# EAGLE schematic ScaleBreakoutBoard2.0 (3) (EAGLE 9.6.2)
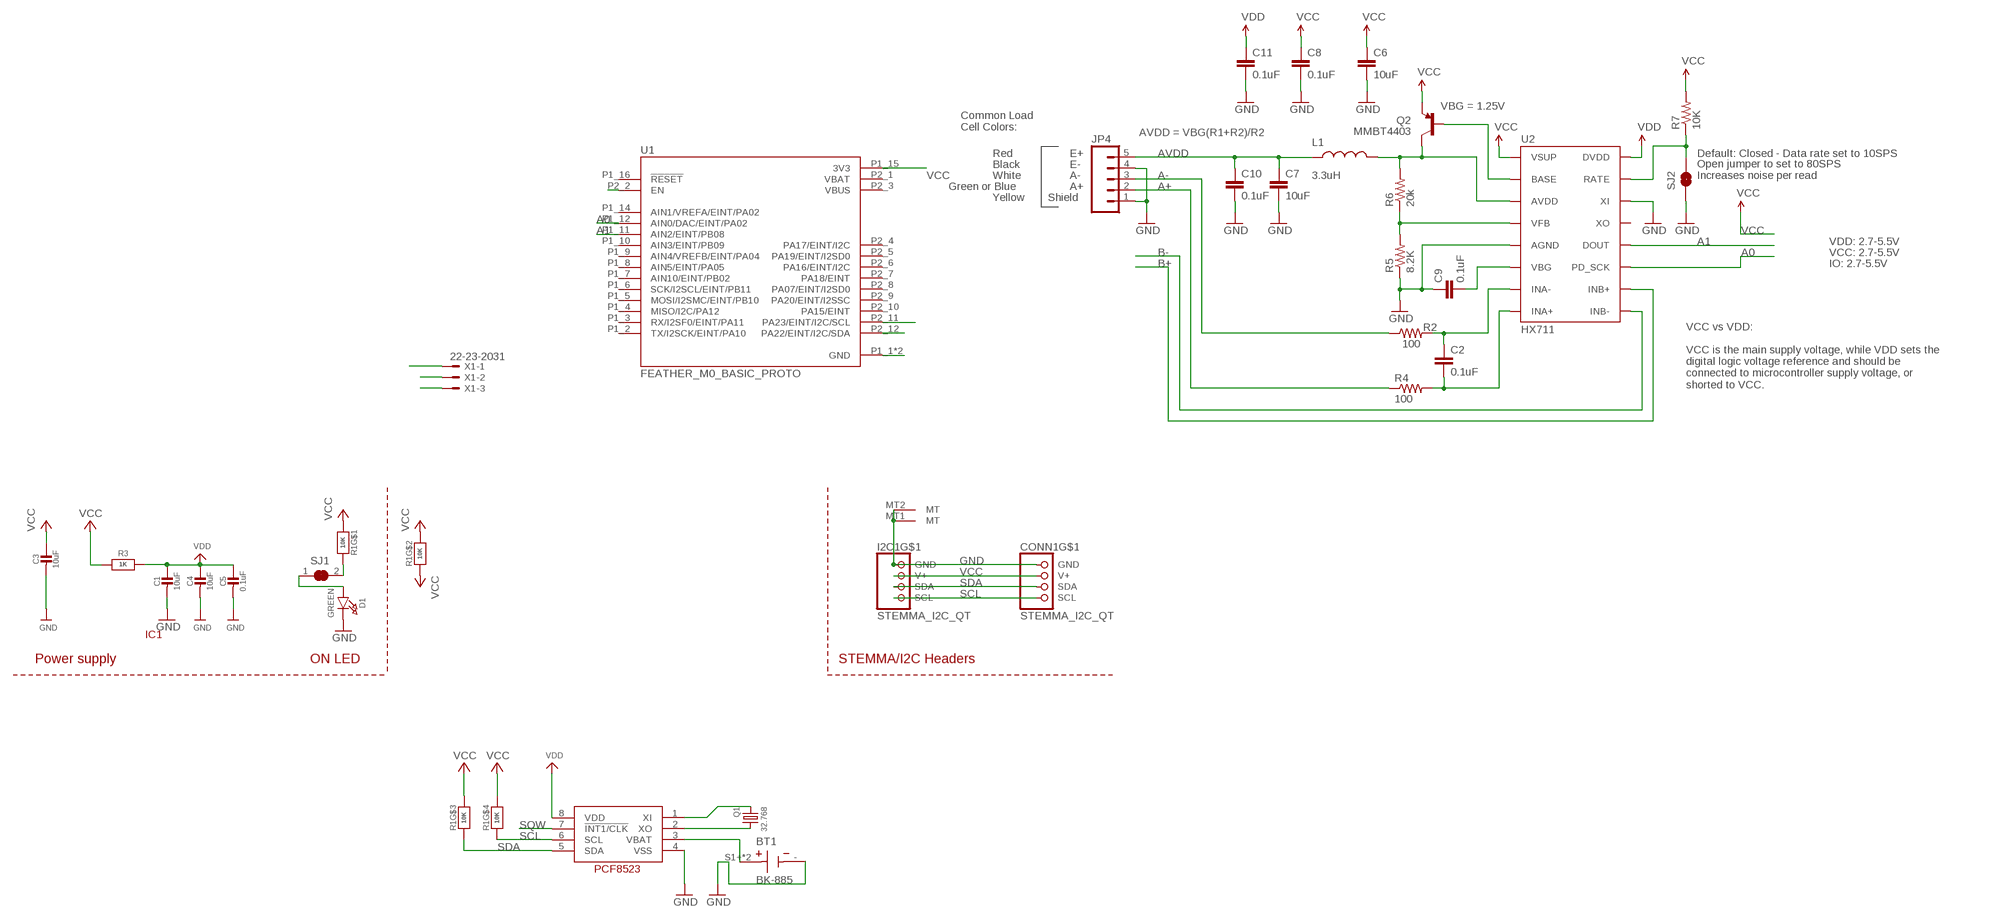
[diagram p0: schematic, sheet 1]

## Parts
BT1  BK-885  [BAT_BK-885]
C1  10uF  CAP_CERAMIC0805-NOOUTLINE  [0805-NO]
C2  0.1uF  0.1UF-25V-5%(0603)  [0603-CAP]
C3  10uF  CAP_CERAMIC0805-NOOUTLINE  [0805-NO]
C4  10uF  CAP_CERAMIC0805-NOOUTLINE  [0805-NO]
C5  0.1uF  CAP_CERAMIC0603_NO  [0603-NO]
C6  10uF  10UF50V20%(1210)  [1210]
C7  10uF  10UF50V20%(1210)  [1210]
C8  0.1uF  0.1UF-25V-5%(0603)  [0603-CAP]
C9  0.1uF  0.1UF-25V-5%(0603)  [0603-CAP]
C10  0.1uF  0.1UF-25V-5%(0603)  [0603-CAP]
C11  0.1uF  0.1UF-25V-5%(0603)  [0603-CAP]
CONN1  STEMMA_I2C_QT  [JST_SH4]
D1  GREEN  LED0603_NOOUTLINE  [CHIPLED_0603_NOOUTLINE]
I2C1  STEMMA_I2C_QT  [JST_SH4]
IC1  RTC_PCF8523T  [SOIC8_150MIL]
JP4  M05PTH  [1X05]
L1  3.3uH  INDUCTOR0805-IND  [0805]
Q1  32.768  CRYSTAL_3215  [XTAL3215]
Q2  MMBT4403  TRANSISTOR_PNPMMBT4403  [SOT23-3]
R1  10K  RESISTOR_4PACK  [RESPACK_4X0603]
R2  100  100OHM-1/10W-1%(0603)  [0603-RES]
R3  1K  RESISTOR_0603_NOOUT  [0603-NO]
R4  100  100OHM-1/10W-1%(0603)  [0603-RES]
R5  8.2K  8.2KOHM-1/10W-5%(0603)  [0603-RES]
R6  20k  20KOHM1/10W1%(0603)  [0603-RES]
R7  10K  10KOHM-1/10W-1%(0603)0603  [0603-RES]
SJ1  SOLDERJUMPER_CLOSED  [SOLDERJUMPER_CLOSEDWIRE]
SJ2  JUMPER-PAD-2-NC_BY_TRACE  [PAD-JUMPER-2-NC_BY_TRACE_YES_SILK]
U1  FEATHER_M0_BASIC_PROTO  [MODULE_FEATHER_M0_BASIC_PROTO]
U2  HX711  HX711HX711  [SO16]
X1  22-23-2031  [22-23-2031]

## Nets
A0: U1.P1_12(AIN0/DAC/EINT/PA02) U2.11(PD_SCK)
A1: U1.P1_11(AIN2/EINT/PB08) U2.12(DOUT)
A+: JP4.2 R4.1
A-: JP4.3 R2.1
AVDD: C7.1 C10.1 JP4.5 L1.1
B+: U2.10(INB+)
B-: U2.9(INB-)
EN: U1.P2_2(EN) X1.3
GND: BT1.- C1.2 C3.2 C4.2 C5.2 C6.2 C7.2 C8.2 C9.1 C10.2 C11.2 CONN1.1(GND) D1.C I2C1.1(GND) I2C1.MT1(MT) I2C1.MT2(MT) IC1.4(VSS) JP4.1 JP4.4 R5.1 SJ2.1 U1.P1_1(GND) U1.P1_13(GND) U2.5(AGND) U2.14(XI) X1.1 X1.2
N$1: R1.8 SJ1.2
N$2: Q2.1(B) U2.2(BASE)
N$3: R7.1 SJ2.2 U2.15(RATE)
N$4: D1.A SJ1.1
N$5: L1.2 Q2.3(C) R6.2 U2.3(AVDD)
N$6: R5.2 R6.1 U2.4(VFB)
N$7: C9.2 U2.6(VBG)
N$8: C2.1 R2.2 U2.7(INA-)
N$9: C2.2 R4.2 U2.8(INA+)
N$14: IC1.1(XI) Q1.P$1
N$15: IC1.2(XO) Q1.P$2
SCL: CONN1.4(SCL) I2C1.4(SCL) IC1.6(SCL) R1.4 U1.P2_11(PA23/EINT/I2C/SCL)
SDA: CONN1.3(SDA) I2C1.3(SDA) IC1.5(SDA) R1.3 U1.P2_12(PA22/EINT/I2C/SDA)
SQW: IC1.7(!INT1/CLK)
VBAT1: BT1.S1+(+) BT1.S2+(+) IC1.3(VBAT)
VCC: C3.1 C6.1 C8.1 CONN1.2(V+) I2C1.2(V+) Q2.2(E) R1.1 R1.2 R1.5 R1.6 R1.7 R3.1 R7.2 U1.P1_15(3V3) U2.1(VSUP)
VDD: C1.1 C4.1 C5.1 C11.1 IC1.8(VDD) R3.2 U2.16(DVDD)
Unconnected: CONN1.MT1(MT) CONN1.MT2(MT) U1.P1_2(TX/I2SCK/EINT/PA10) U1.P1_3(RX/I2SF0/EINT/PA11) U1.P1_4(MISO/I2C/PA12) U1.P1_5(MOSI/I2SMC/EINT/PB10) U1.P1_6(SCK/I2SCL/EINT/PB11) U1.P1_7(AIN10/EINT/PB02) U1.P1_8(AIN5/EINT/PA05) U1.P1_9(AIN4/VREFB/EINT/PA04) U1.P1_10(AIN3/EINT/PB09) U1.P1_14(AIN1/VREFA/EINT/PA02) U1.P1_16(!RESET) U1.P2_4(PA17/EINT/I2C) U1.P2_5(PA19/EINT/I2SD0) U1.P2_6(PA16/EINT/I2C) U1.P2_7(PA18/EINT) U1.P2_8(PA07/EINT/I2SD0) U1.P2_9(PA20/EINT/I2SSC) U1.P2_10(PA15/EINT) U2.13(XO)

## Notes on the sheet
- VBG = 1.25V
- Common Load
  Cell Colors:
- AVDD = VBG(R1+R2)/R2
- Red | E+ | Default: Closed - Data rate set to 10SPS
- Black | E-
- White | A-
- Open jumper to set to 80SPS
  Increases noise per read
- Green or Blue | A+
- Yellow | Shield
- VDD: 2.7-5.5V
- VCC: 2.7-5.5V
- IO: 2.7-5.5V
- VCC vs VDD:
  
  VCC is the main supply voltage, while VDD sets the
  digital logic voltage reference and should be
  connected to microcontroller supply voltage, or
  shorted to VCC.
- Power supply | ON LED | STEMMA/I2C Headers

## Power pins joined to a net without a drawn wire
VBAT: U1.P2_1(VBAT)
VBUS: U1.P2_3(VBUS)

## Library data of the parts
BT1 = BK-885:BK-885: BATTERY RETAINER COIN 12MM SMD Check prices <https://pricing.snapeda.com/parts/BK-885/MPD/view-part?ref=eda>; AVAILABILITY: In Stock; DESCRIPTION: BATTERY RETAINER COIN 12MM SMD; MF: MPD; MP: BK-885; PACKAGE: None; PRICE: None; PURCHASE-URL: https://pricing.snapeda.com/search/part/BK-885/?ref=eda
C1 C3-C5 = microbuilder:CAP_CERAMIC: Ceramic Capacitors For new designs, use the packages preceded by an '_' character since they are more reliable: The following footprints should be used on most boards: _0402 - Standard footprint for regular board layouts _0603 - Standard footprint for regular board layouts _0805 - Standard footprint for regular board layouts _1206 - Standard footprint for regular board layouts For extremely tight-pitch boards where space is at a premium, the following 'micro-pitch' footprints can be used (smaller pads, no silkscreen outline, etc.): _0402MP - Micro-pitch footprint for very dense/compact boards _0603MP - Micro-pitch footprint for very dense/compact boards _0805MP - Micro-pitch footprint for very dense/compact boards _1206MP - Micro-pitch footprint for very dense/compact boards
C2 C8-C11 = SparkFun-Capacitors:0.1UF-25V-5%(0603): CAP-08604; PROD_ID: CAP-08604
C6 C7 = SparkFun-Capacitors:10UF50V20%(1210): CAP-09824; PROD_ID: CAP-09824
CONN1 I2C1 = microbuilder:STEMMA_I2C
D1 = microbuilder:LED: LED 0603 - 0603 Surface Mount Package 2mA: Green LED - Low Power (3.9mcd, 2ma, 1.7Vf) - Digikey: 475-2709-2-ND Orange LED - Low Power (9.8mcd, 2ma, 1.8Vf) - Digikey: 475-1194-2-ND Red LED - Low Power (5mcd, 2ma, 1.8Vf) - Digikey: 475-1195-2-ND Yellow LED - Low Power (7mcd, 2ma, 1.8Vf) - Digikey: 475-1196-2-ND 5mA: Blue LED - Low Power (17mcd, 5ma, 2.9Vf) - Digikey: LNJ937W8CRACT-ND 0805 - 0805 Surface Mount Package 2mA: Red LED (8.8mcd, 2mA, 1.8Vf, Clear) - Low Power [Digikey: 475-2510-1-ND] Green LED (5mcd, 2mA, 1.8Vf, Clear) - Low Power [Digikey: 475-2730-1-ND] Yellow LED (11.3mcd, 2mA, 1.8Vf, Clear) - Low Power [Digikey: 475-2555-1-ND] 20mA: Red LED (104mcd, 20mA, Diffused) - LS R976 [Digikey: 475-1278-6-ND] Red LED (12mcd, 20mA, 2.0Vf, Clear) - APT2012EC [Digikey: 754-1128-1-ND] Green LED (15mcd, 20mA, 2.2Vf, Clear) - APT2012GC [Digikey: 754-1131-1-ND] Orange LED (160mcd, 20mA, 2.1Vf, Clear) - APT2012SECK [Digikey: 754-1130-1-ND] 1206 - 1206 Surface Mount Package Green LED (26mcd, 20mA, Diffused) - LG N971 [Digikey: 475-1407-6-ND] Red LED (15mcd, 20mA, Diffused) - LH N974 [Digikey: 475-1416-6-ND] Cree - Cree High-Power Surface Mount LEDs XPEBWT-L1-0000-00D50 - White 111lm 350mA 2.9Vf 6200K 110° XTEAWT-00-0000-00000LEE3 - White 114lm 350mA 2.85Vf 5000K 115° Everlight - Everlight 45-21 Series Surface Mount LEDs 45-21/QK2C-B2832AC2CB2/2T - Warm White 2000mcd 20mA 3.25Vf 3050K 120° 45-21/LK2C-B38452C4CB2/2T - Nuetral White 2000mcd 20mA 3.25Vf 4150K 120° 45-21/LK2C-B50634C6CB2/2T - Cold White 2200mcd 20mA 3.25Vf 5650K 120° PLCC2 Reverse Mount LS T77K-J1L2-1-0-2-R18-Z - Red 11.25mcd 2mA 1.8Vf 630nm 120° LO T77K-L1M2-24-Z - Orange 19.6mcd 2mA 1.8Vf 606nm 120° LY T77K-K2M1-26-Z - Yellow 15.7mcd 2mA 1.8Vf 587nm 120°
IC1 = microbuilder:RTC_PCF8523
JP4 = SparkFun-Connectors:M05: Header 5 Standard 5-pin 0.1" header. Use with straight break away headers (SKU : PRT-00116), right angle break away headers (PRT-00553), swiss pins (PRT-00743), machine pins (PRT-00117), and female headers (PRT-00115). Molex polarized connector foot print use with SKU : PRT-08230 with associated crimp pins and housings.
L1 = SparkFun-Passives:INDUCTOR: Inductors Basic Inductor/Choke - 0603 and 1206. Footprints are not proven and vary greatly between part numbers. INDUCTOR POWER 3.3UH 4.0A SMD 0.197" L x 0.197" W x 0.177" H (5.00mm x 5.00mm x 4.50mm); PROD_ID: NDUC-13076
Q1 = microbuilder:CRYSTAL: Crystals HC49UP - Surface Mount Crystal 4.0MHz 18pF +/-30ppm Surface Mount Crystal [Digikey: 535-9857-1-ND] 12.0 MHz Surface Mount Crystal [Digikey: 535-9869-6-ND] 25.0 MHz Surface Mount Crystal [Digikey: 535-9078-1-ND] 2.5 x 2.0mm - MEMs SMT Crystal 16.0 MHz 10pF 20ppm 2.5 x 2.0mm Crystal [Digikey -40-85°C: 535-10923-1-ND] 3.2 x 2.5mm - MEMs SMT Crystal 12.0 MHz 8pF 15ppm 3.2 x 2.5mm Crystal [Digikey: -10-70°C: 644-1047-1-ND -40-125°C: 644-1128-1-ND] 40~85°C cheaper: 644-1173-6-ND 16.0 MHz 8pF 15ppm 3.2 x 2.5mm Crystal [Digikey: -10-70°C: 644-1049-1-ND -40-125°C: 644-1129-2-ND]-40~85°C cheaper: 644-1175-6-ND 16.0 MHz 10pF 10ppm 3.2 x 2.5mm Crystal [Digikey: 644-1100-1-ND] 27.12 MHz 18pF 30ppm 3.2 x 2.5mm Crystal [Digikey: 887-1424-1-ND] 27.12MHz 10pF 10ppm 3.2 x 2.5mm Crystal [Digikey: 887-1329-1-ND] 4.9 x 1.8mm - MEMs SMT Crystal 32.768 KHz 12.5pF 20ppm 4.9 x 1.8mm Crystal [Digikey: SE2415CT-ND] 8.0 x 3.8mm - Surface Mount Crystal 32.768kHz 12.5pF 20ppm -40°C-85°C [Digikey: 535-9166-2-ND] Cylinder 32.768KHz Cylinder Crystal (2x6mm body) [Ex. Digikey: 300-8341-2-ND]
Q2 = SparkFun-DiscreteSemi:TRANSISTOR_PNP: Generic PNP BJT Double check pinouts against datasheets- not all devices are the same! MMBT3906 - 40V 200mA SOT-23 (TRANS-08052) MMBT4403 - 40V 600mA SOT-23 (TRANS-09245); PROD_ID: TRANS-09245
R1 = microbuilder:RESISTOR_4PACK: Resistor Packs (4 resistors) 4 x 0603 10K 1/16W - Digikey: YC164J-10KCT-ND
R2 R4 = SparkFun-Resistors:100OHM-1/10W-1%(0603): RES-07863; PROD_ID: RES-07863
R3 = microbuilder:RESISTOR: Resistors For new designs, use the packages preceded by an '_' character since they are more reliable: The following footprints should be used on most boards: _0402 - Standard footprint for regular board layouts _0603 - Standard footprint for regular board layouts _0805 - Standard footprint for regular board layouts _1206 - Standard footprint for regular board layouts For extremely tight-pitch boards where space is at a premium, the following 'micro-pitch' footprints can be used (smaller pads, no silkscreen outline, etc.): _0402MP - Micro-pitch footprint for very dense/compact boards _0603MP - Micro-pitch footprint for very dense/compact boards _0805MP - Micro-pitch footprint for very dense/compact boards _1206MP - Micro-pitch footprint for very dense/compact boards
R5 = SparkFun-Resistors:8.2KOHM-1/10W-5%(0603): RES-10646; PROD_ID: RES-10646
R6 = SparkFun-Resistors:20KOHM1/10W1%(0603): RES-09383; PROD_ID: RES-09383
R7 = SparkFun-Resistors:10KOHM-1/10W-1%(0603): RES-00824; PROD_ID: RES-00824
SJ1 = microbuilder:SOLDERJUMPER_CLOSED: Solder Jumper - Closed These solder jumpers are closed by default CLOSEDWIRE - 10 mil trace between pads that can be cut and resoldered later CLOSEDPERM - 63 mil trace between pads for a permanent connection (used to 'bridge' two signals, a shameless hack for Eagle). Can double as a test point as well (no cream layer)
SJ2 = SparkFun-Passives:JUMPER-PAD-2-NC_BY_TRACE
U1 = FEATHER_M0_BASIC_PROTO:FEATHER_M0_BASIC_PROTO: ATSAMD21G18 Feather M0 Basic Proto SAM D ARM® Cortex®-M0+ MCU 32-Bit Embedded Evaluation Board Check prices <https://pricing.snapeda.com/parts/Feather%20M0%20Basic%20Proto/Adafruit%20Industries/view-part?ref=eda>; AVAILABILITY: No availability data; DESCRIPTION: ATSAMD21G18 Feather M0 Basic Proto SAM D ARM® Cortex®-M0+ MCU 32-Bit Embedded Evaluation Board; MF: Adafruit Industries; MP: Feather M0 Basic Proto; PACKAGE: Package; PRICE: None
U2 = Testing:HX711; PROD_ID: IC-12445
X1 = con-molex:22-23-2031: .100" (2.54mm) Center Header - 3 Pin; MF: MOLEX; MPN: 22-23-2031; OC_FARNELL: 1462950; OC_NEWARK: 30C0862